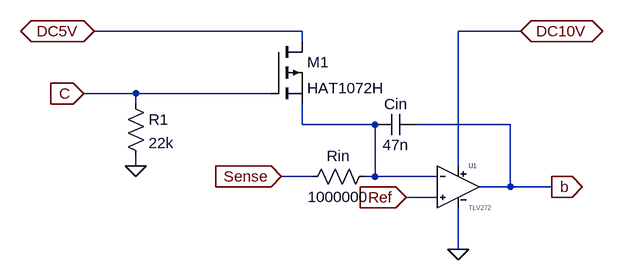
[diagram p0: schematic feedback_control.asc]
feedback_control.asc, the LTspice schematic file:
Version 4
SHEET 1 880 680
WIRE 336 64 16 64
WIRE 672 64 576 64
WIRE 336 80 336 64
WIRE 80 160 0 160
WIRE 288 160 80 160
WIRE 80 176 80 160
WIRE 336 208 336 176
WIRE 448 208 336 208
WIRE 656 208 512 208
WIRE 80 272 80 256
WIRE 576 272 576 64
WIRE 352 288 304 288
WIRE 448 288 448 208
WIRE 448 288 432 288
WIRE 544 288 448 288
WIRE 656 304 656 208
WIRE 656 304 608 304
WIRE 720 304 656 304
WIRE 544 320 496 320
WIRE 576 400 576 336
FLAG 16 64 DC5V
IOPIN 16 64 BiDir
FLAG 0 160 C
IOPIN 0 160 In
FLAG 304 288 Sense
IOPIN 304 288 In
FLAG 496 320 Ref
IOPIN 496 320 In
FLAG 672 64 DC10V
IOPIN 672 64 BiDir
FLAG 720 304 b
IOPIN 720 304 Out
FLAG 80 272 0
FLAG 576 400 0
SYMBOL pmos 288 80 R0
SYMATTR InstName M1
SYMATTR Value HAT1072H
SYMBOL res 64 160 R0
SYMATTR InstName R1
SYMATTR Value 22k
SYMBOL TLV272 576 304 R0
SYMATTR InstName U1
SYMBOL cap 512 192 R90
WINDOW 0 0 32 VBottom 2
WINDOW 3 32 32 VTop 2
SYMATTR InstName Cin
SYMATTR Value 47n
SYMBOL res 448 272 R90
WINDOW 0 0 56 VBottom 2
WINDOW 3 32 56 VTop 2
SYMATTR InstName Rin
SYMATTR Value 1000000

The netlist it stands for:
* feedback_control.asc
M1 DC5V C N001 N001 HAT1072H
R1 C 0 22k
XU1 Ref N001 DC10V 0 b level.2 Avol=1Meg GBW=3Meg Slew=2.4Meg ilimit=20m rail=0.1 Vos=0 phimargin=45 en=0 enk=0 in=0 ink=0 Rin=500Meg  ; pins In+ In- V+ V- OUT
Cin b N001 47n
Rin N001 Sense 1000000
.model NMOS NMOS
.model PMOS PMOS
.lib standard.mos
.lib UniversalOpamps2.sub
.backanno
.end